# EAGLE design mgnt-001 (EAGLE 9.6.2)
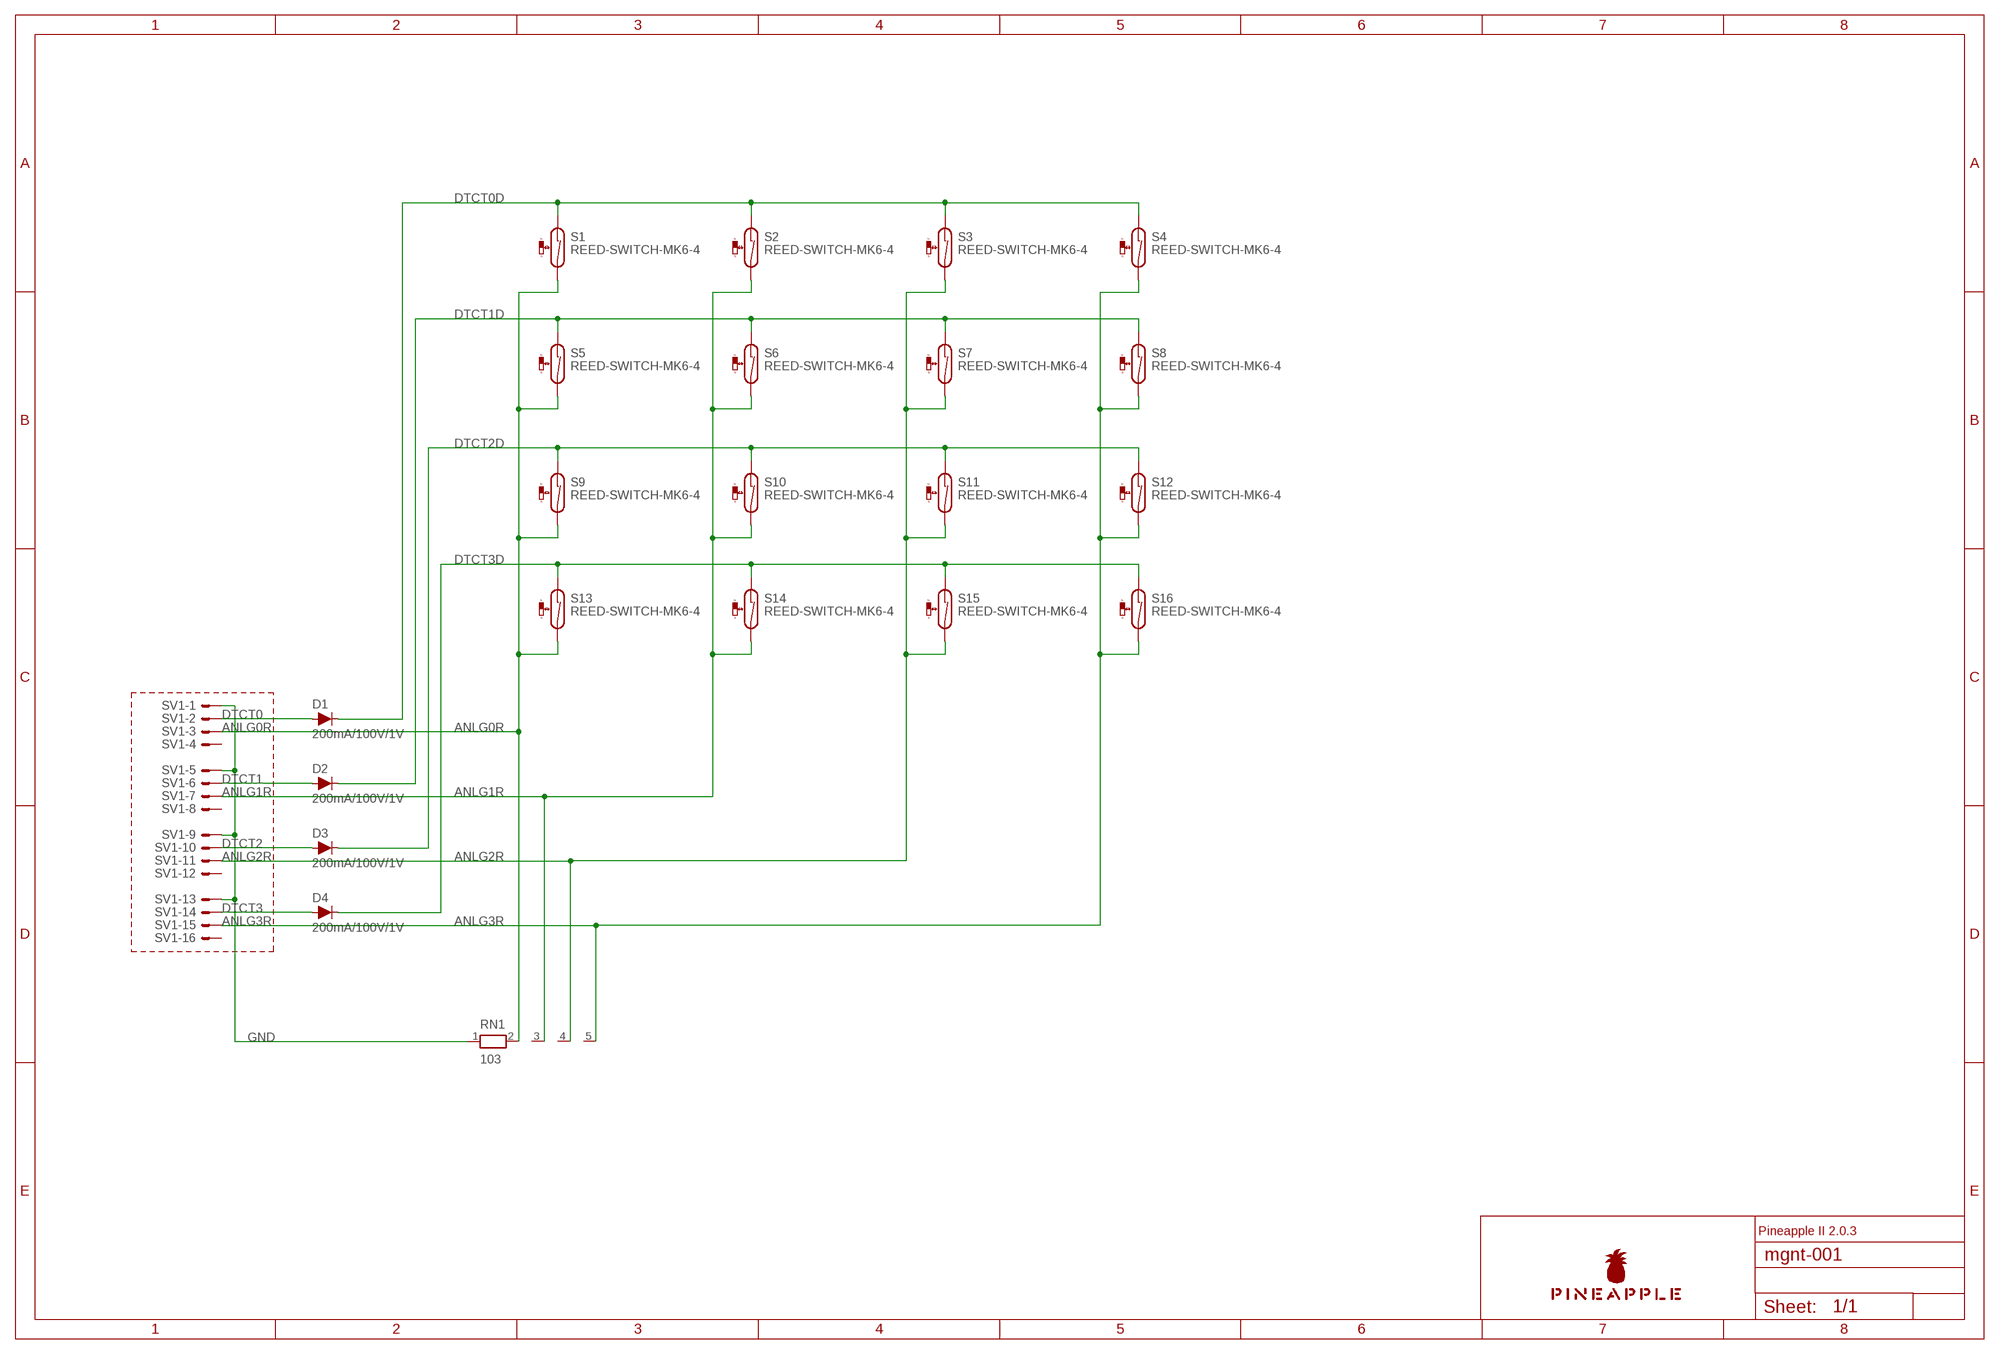
[diagram p0: schematic, sheet 1]

## Parts
D1  200mA/100V/1V  DIODE-1N4148  [DIODE-1N4148]
D2  200mA/100V/1V  DIODE-1N4148  [DIODE-1N4148]
D3  200mA/100V/1V  DIODE-1N4148  [DIODE-1N4148]
D4  200mA/100V/1V  DIODE-1N4148  [DIODE-1N4148]
RN1  103  RN04  [RN-5]
S1  REED-SWITCH-MK6-4  [MK6-4]
S2  REED-SWITCH-MK6-4  [MK6-4]
S3  REED-SWITCH-MK6-4  [MK6-4]
S4  REED-SWITCH-MK6-4  [MK6-4]
S5  REED-SWITCH-MK6-4  [MK6-4]
S6  REED-SWITCH-MK6-4  [MK6-4]
S7  REED-SWITCH-MK6-4  [MK6-4]
S8  REED-SWITCH-MK6-4  [MK6-4]
S9  REED-SWITCH-MK6-4  [MK6-4]
S10  REED-SWITCH-MK6-4  [MK6-4]
S11  REED-SWITCH-MK6-4  [MK6-4]
S12  REED-SWITCH-MK6-4  [MK6-4]
S13  REED-SWITCH-MK6-4  [MK6-4]
S14  REED-SWITCH-MK6-4  [MK6-4]
S15  REED-SWITCH-MK6-4  [MK6-4]
S16  REED-SWITCH-MK6-4  [MK6-4]
SV1  ML16LE  [ML16L]
U$1  PINEAPPLELOGO2  [PINEAPPLELOGO2]

## Nets
ANLG0R [analog]: RN1.2 S1.2 S5.2 S9.2 S13.2 SV1.3
ANLG1R [analog]: RN1.3 S2.2 S6.2 S10.2 S14.2 SV1.7
ANLG2R [analog]: RN1.4 S3.2 S7.2 S11.2 S15.2 SV1.11
ANLG3R [analog]: RN1.5 S4.2 S8.2 S12.2 S16.2 SV1.15
DTCT0: D1.A SV1.2
DTCT0D: D1.C S1.1 S2.1 S3.1 S4.1
DTCT1: D2.A SV1.6
DTCT1D: D2.C S5.1 S6.1 S7.1 S8.1
DTCT2: D3.A SV1.10
DTCT2D: D3.C S9.1 S10.1 S11.1 S12.1
DTCT3: D4.A SV1.14
DTCT3D: D4.C S13.1 S14.1 S15.1 S16.1
GND [gnd]: RN1.1 SV1.1 SV1.5 SV1.9 SV1.13
Unconnected: SV1.4 SV1.8 SV1.12 SV1.16

## Notes on the sheet
- Pineapple II 2.0.3

## Library data of the parts
D1-D4 = SparkFun-DiscreteSemi:DIODE: Diode These are standard reverse protection diodes and small signal diodes. SparkFun Products: SparkFun SparkPunk Sound Kit <https://www.sparkfun.com/products/11177> SparkFun ESP8266 Thing <https://www.sparkfun.com/products/13231>; PROD_ID: DIO-08378
RN1 = resistor-net:RN04: RESISTOR NETWORK; OC_FARNELL: unknown; OC_NEWARK: unknown
S1-S16 = switch-reed:REED-SWITCH-: Reed Sensor; OC_FARNELL: unknown
SV1 = con-ml:ML16LE: HARTING; OC_FARNELL: unknown; OC_NEWARK: unknown
U$1 = pineapplelogo:PINEAPPLELOGO2

## Net classes
0 default: width 0.152 mm, drill 0.152 mm, clearance 0.152 mm
1 gnd: width 0.305 mm, drill 0.152 mm, clearance 0.152 mm
2 power: width 0.508 mm, drill 0.152 mm, clearance 0.152 mm
3 analog: width 0.305 mm, drill 0.152 mm, clearance 0.152 mm
4 superpower: width 1.016 mm, drill 0.152 mm, clearance 0.152 mm

## Board
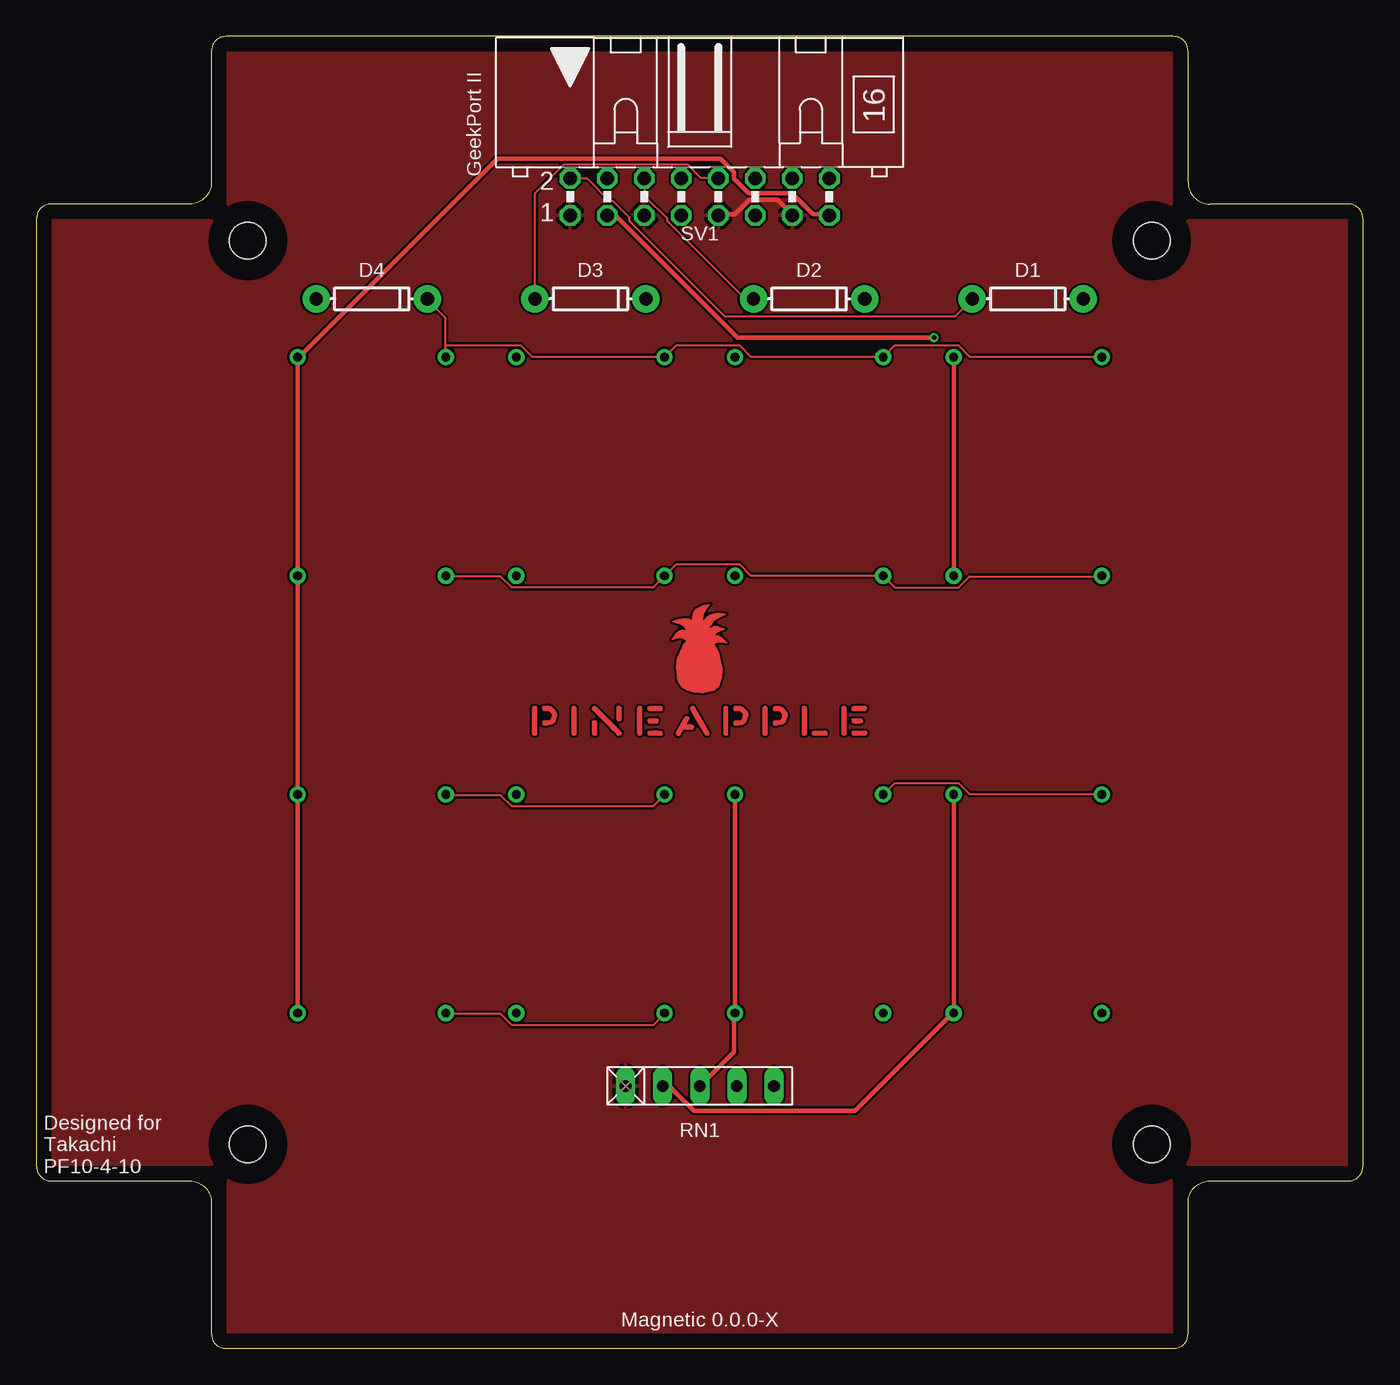
[diagram p1: board, top side]
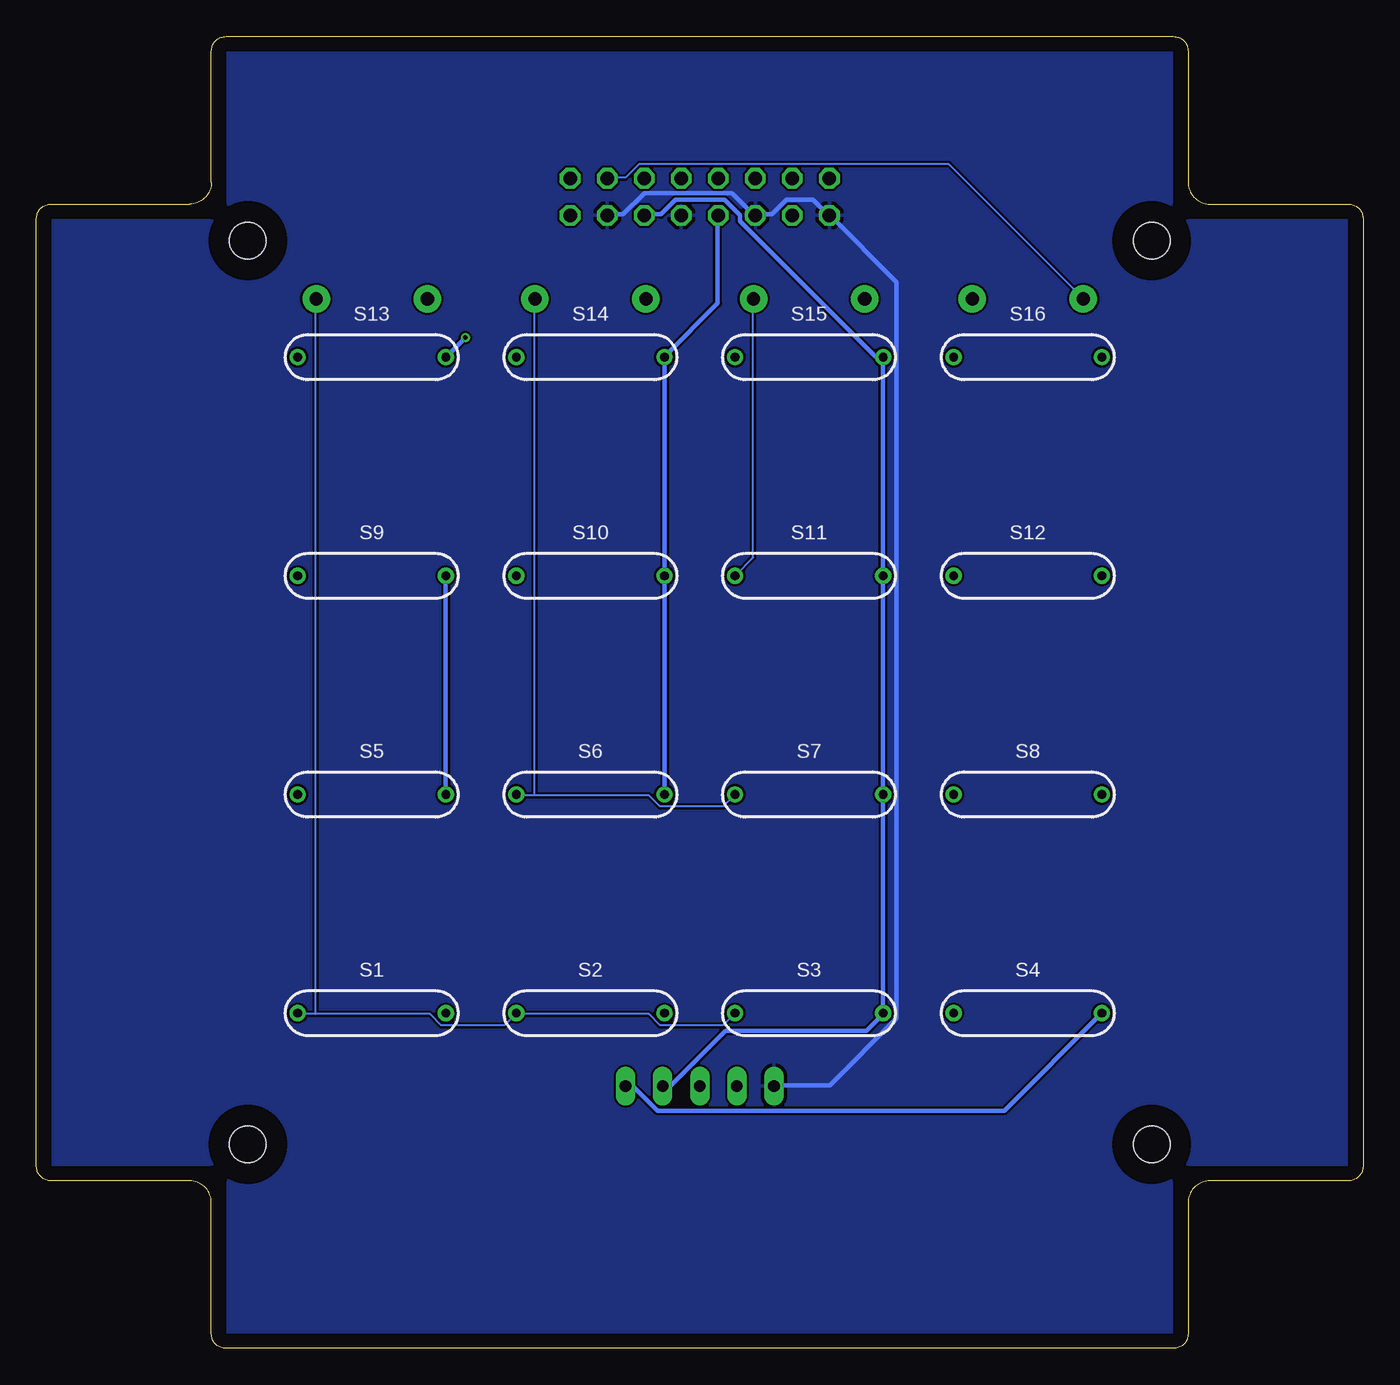
[diagram p2: board, bottom side, seen from below]

Size 91 x 90 mm. Coordinates in mm from the lower left corner, seen from the top.
Outline: 78,90 13,90 arc90 12,89 12,80 arc-90 10.5,78.5 1,78.5 arc90 0,77.5 0,12.5 arc90 1,11.5 10.5,11.5 arc-90 12,10 12,1 arc90 13,0 78,0 arc90 79,1 79,10 arc-90 80.5,11.5 90,11.5 arc90 91,12.5 91,77.5 arc90 90,78.5 80.5,78.5 arc-90 79,80 79,89 arc90 78,90
Copper layers (1*16): Top 0.035mm / dielectric 1.5mm / Bottom 0.035mm
Design rules "SeeedStudio_2layer_DRU_no_angle_20140221": minimum track width 6mil, minimum drill 12mil, track to track 6mil, track to pad 6mil, pad to pad 6mil, via to via 6mil, smd to smd 0mil, copper to edge 10mil, drill to drill 10mil, minimum pad ring 10mil, minimum via ring 6mil, stop-mask expansion 2mil, vias tented up to drill 100mil, thermal gap 10mil
Holes 2.5 mm at 76.5,76 14.5,14 76.5,14 14.5,76
tKeepout: area 34,42 to 57,51
tRestrict: area 11.9,73.4 to 17.1,78.6; area 73.9,73.4 to 79.1,78.6; area 11.9,11.4 to 17.1,16.6; area 73.9,11.4 to 79.1,16.6; area 12,89 to 79,90; area 90,11.5 to 91,78.5; area 12,0 to 79,1; area 0,11.5 to 1,78.5; area 0,77.5 to 12,78.5; area 12,78.5 to 13,90; area 78,78.5 to 79,90; area 79,77.5 to 91,78.5; 8 more areas
bRestrict: area 11.9,11.4 to 17.1,16.6; area 73.9,11.4 to 79.1,16.6; area 73.9,73.4 to 79.1,78.6; area 11.9,73.4 to 17.1,78.6; area 78,0 to 79,11.5; area 79,11.5 to 91,12.5; area 90,11.5 to 91,78.5; area 79,77.5 to 91,78.5; area 78,78.5 to 79,90; area 12,89 to 79,90; area 12,78.5 to 13,90; area 0,77.5 to 12,78.5; 8 more areas

### Footprints (pad centres in the part's own frame; a part is rotated, then mirrored left to right if it is on the bottom)
DIODE-1N4148 = drill 0.9 pad 1.88: A -3.81,0; C 3.81,0
RN-5 = drill 0.813 long: 1 -5.08,0; 2 -2.54,0; 3 0,0; 4 2.54,0; 5 5.08,0
MK6-4 = drill 0.6 pad 1.016: 1 -5.08,0; 2 5.08,0
ML16L = drill 0.914 octagon: 1 -8.89,-1.27; 2 -8.89,1.27; 3 -6.35,-1.27; 4 -6.35,1.27; 5 -3.81,-1.27; 6 -3.81,1.27; 7 -1.27,-1.27; 8 -1.27,1.27; 9 1.27,-1.27; 10 1.27,1.27; 11 3.81,-1.27; 12 3.81,1.27; 13 6.35,-1.27; 14 6.35,1.27; 15 8.89,-1.27; 16 8.89,1.27

### Placement (x,y rotation side)
D1  68,72 0 top
D2  53,72 0 top
D3  38,72 0 top
D4  23,72 0 top
RN1  45.5,18 0 top
S1  68,23 0 bottom
S2  53,23 0 bottom
S3  38,23 0 bottom
S4  23,23 0 bottom
S5  68,38 0 bottom
S6  53,38 0 bottom
S7  38,38 0 bottom
S8  23,38 0 bottom
S9  68,53 0 bottom
S10  53,53 0 bottom
S11  38,53 0 bottom
S12  23,53 0 bottom
S13  68,68 0 bottom
S14  53,68 0 bottom
S15  38,68 0 bottom
S16  23,68 0 bottom
SV1  45.5,79 0 top
U$1  45.5,42 0 top

### Tracks (layer width: path | path; a pad name or v marks a point on that pad's centre or on a via)
ANLG0R  (via drill 0.3)
  Top 0.305: S5.2 62.94,37.95 62.94,23.01 S1.2 62.79,22.94 56.16,16.31 45.11,16.31 43.43,17.98 42.98,17.98 RN1.2 | S9.2 62.94,53.03 62.94,67.97 S13.2 | v61.57,69.34 48.08,69.34 39.7,77.72 39.17,77.72 SV1.3
  Bottom 0.305: v61.57,69.34 62.87,68.05 S13.2 | S5.2 62.94,38.02 62.94,52.96 S9.2
ANLG1R
  Top 0.305: RN1.3 45.57,18.06 47.85,20.34 47.85,22.94 S2.2 47.93,23.09 47.93,37.95 S6.2
  Bottom 0.305: SV1.7 44.27,77.72 44.27,71.7 47.85,68.12 S14.2 47.93,67.97 47.93,53.03 S10.2 47.93,52.88 47.93,38.02 S6.2
ANLG2R
  Bottom 0.305: RN1.4 48.01,18.06 47.47,18.06 43.74,21.79 34.06,21.79 32.99,22.86 S3.2 32.92,23.01 32.92,37.95 S7.2 32.92,38.1 32.92,52.96 S11.2 32.92,53.11 32.92,67.97 S15.2 33.07,68.05 33.45,68.05 42.75,77.34 42.75,77.72 43.81,78.79 47.17,78.79 48.16,77.8 49.3,77.8 SV1.11
ANLG3R
  Top 0.305: S4.2 17.91,23.01 17.91,37.95 S8.2 17.91,38.1 17.91,52.96 S12.2 17.91,53.11 17.91,67.97 S16.2 18.06,68.05 31.62,81.61 46.94,81.61 47.85,80.7 47.85,80.24 48.84,79.25 51.82,79.25 53.26,77.8 54.33,77.8 SV1.15
  Bottom 0.305: RN1.5 50.52,17.98 50.06,17.98 48.39,16.31 24.61,16.31 17.98,22.94 S4.2
DTCT0
  Top 0.152: SV1.2 36.65,80.24 37.8,80.24 39.32,78.72 39.55,78.72 40.69,77.57 40.69,77.34 47.24,70.79 63.02,70.79 64.16,71.93 D1.A
DTCT0D
  Top 0.152: S4.1 28.12,22.94 31.85,22.94 32.61,22.17 42.29,22.17 43.05,22.94 S3.1
  Bottom 0.152: S3.1 43.13,22.94 43.89,22.17 48.23,22.17 49,22.94 58.06,22.94 S2.1 58.14,22.94 58.9,22.17 63.25,22.17 64.01,22.94 71.86,22.94 | 71.86,22.94 73.08,22.94 S1.1 | 71.86,22.94 71.86,71.93 D1.C
DTCT1
  Top 0.152: SV1.6 41.76,80.24 41.76,79.02 43.28,77.5 43.28,77.34 48.62,72.01 49.15,72.01 D2.A
DTCT1D
  Top 0.152: S8.1 28.12,37.95 31.85,37.95 32.61,37.19 42.29,37.19 43.05,37.95 S7.1 | S5.1 73.08,38.02 64.01,38.02 63.25,38.79 58.9,38.79 58.14,38.02 S6.1
  Bottom 0.152: 56.84,37.95 49,37.95 48.23,37.19 43.89,37.19 43.13,37.95 S7.1 | 56.84,37.95 58.06,37.95 S6.1 | 56.84,37.95 56.84,71.93 D2.C
DTCT2
  Top 0.152: SV1.10 46.71,80.31 45.57,80.31 44.65,81.23 36.2,81.23 34.21,79.25 34.21,72.01 D3.A
DTCT2D
  Top 0.152: S12.1 28.12,52.96 31.85,52.96 32.61,52.2 42.29,52.2 43.05,52.96 S11.1 43.13,53.03 43.89,53.8 48.23,53.8 49,53.03 58.06,53.03 S10.1 58.14,52.96 58.9,52.2 63.25,52.2 64.01,52.96 73.08,52.96 S9.1
  Bottom 0.152: D3.C 41.83,71.93 41.83,54.25 43.05,53.03 S11.1
DTCT3
  Bottom 0.152: SV1.14 51.82,80.31 50.6,80.31 49.68,81.23 28.42,81.23 19.2,72.01 D4.A
DTCT3D
  Top 0.152: 28.04,68.81 28.04,70.71 26.82,71.93 D4.C | 28.04,68.81 28.04,68.05 S16.1 | 28.04,68.81 33.22,68.81 33.98,68.05 43.05,68.05 S15.1 43.13,68.05 43.89,68.81 48.23,68.81 49,68.05 58.06,68.05 S14.1 58.14,68.05 58.9,68.81 63.25,68.81 64.01,68.05 73.08,68.05 S13.1
GND
  Top 0.305: SV1.9 46.79,77.8 47.93,77.8 48.92,78.79 50.83,78.79 51.82,77.8 SV1.13
  Bottom 0.305: RN1.1 40.39,18.06 36.58,18.06 32,22.63 32,73.15 36.58,77.72 SV1.1 36.73,77.8 37.72,78.79 39.55,78.79 40.54,77.8 41.68,77.8 SV1.5 41.83,77.8 43.28,79.25 49.3,79.25 50.75,77.8 51.82,77.8 SV1.13
  pour Top: -1,-1 92,-1 92,91 -1,91
  pour Bottom: -2,-2 93,-2 93,92 -2,92

### Text on the board
tNames: GeekPort II | Designed for / Takachi / PF10-4-10 | Magnetic 0.0.0-X